# Altium schematic sheet STM32L4雷达LoRa.SchDoc
size A3
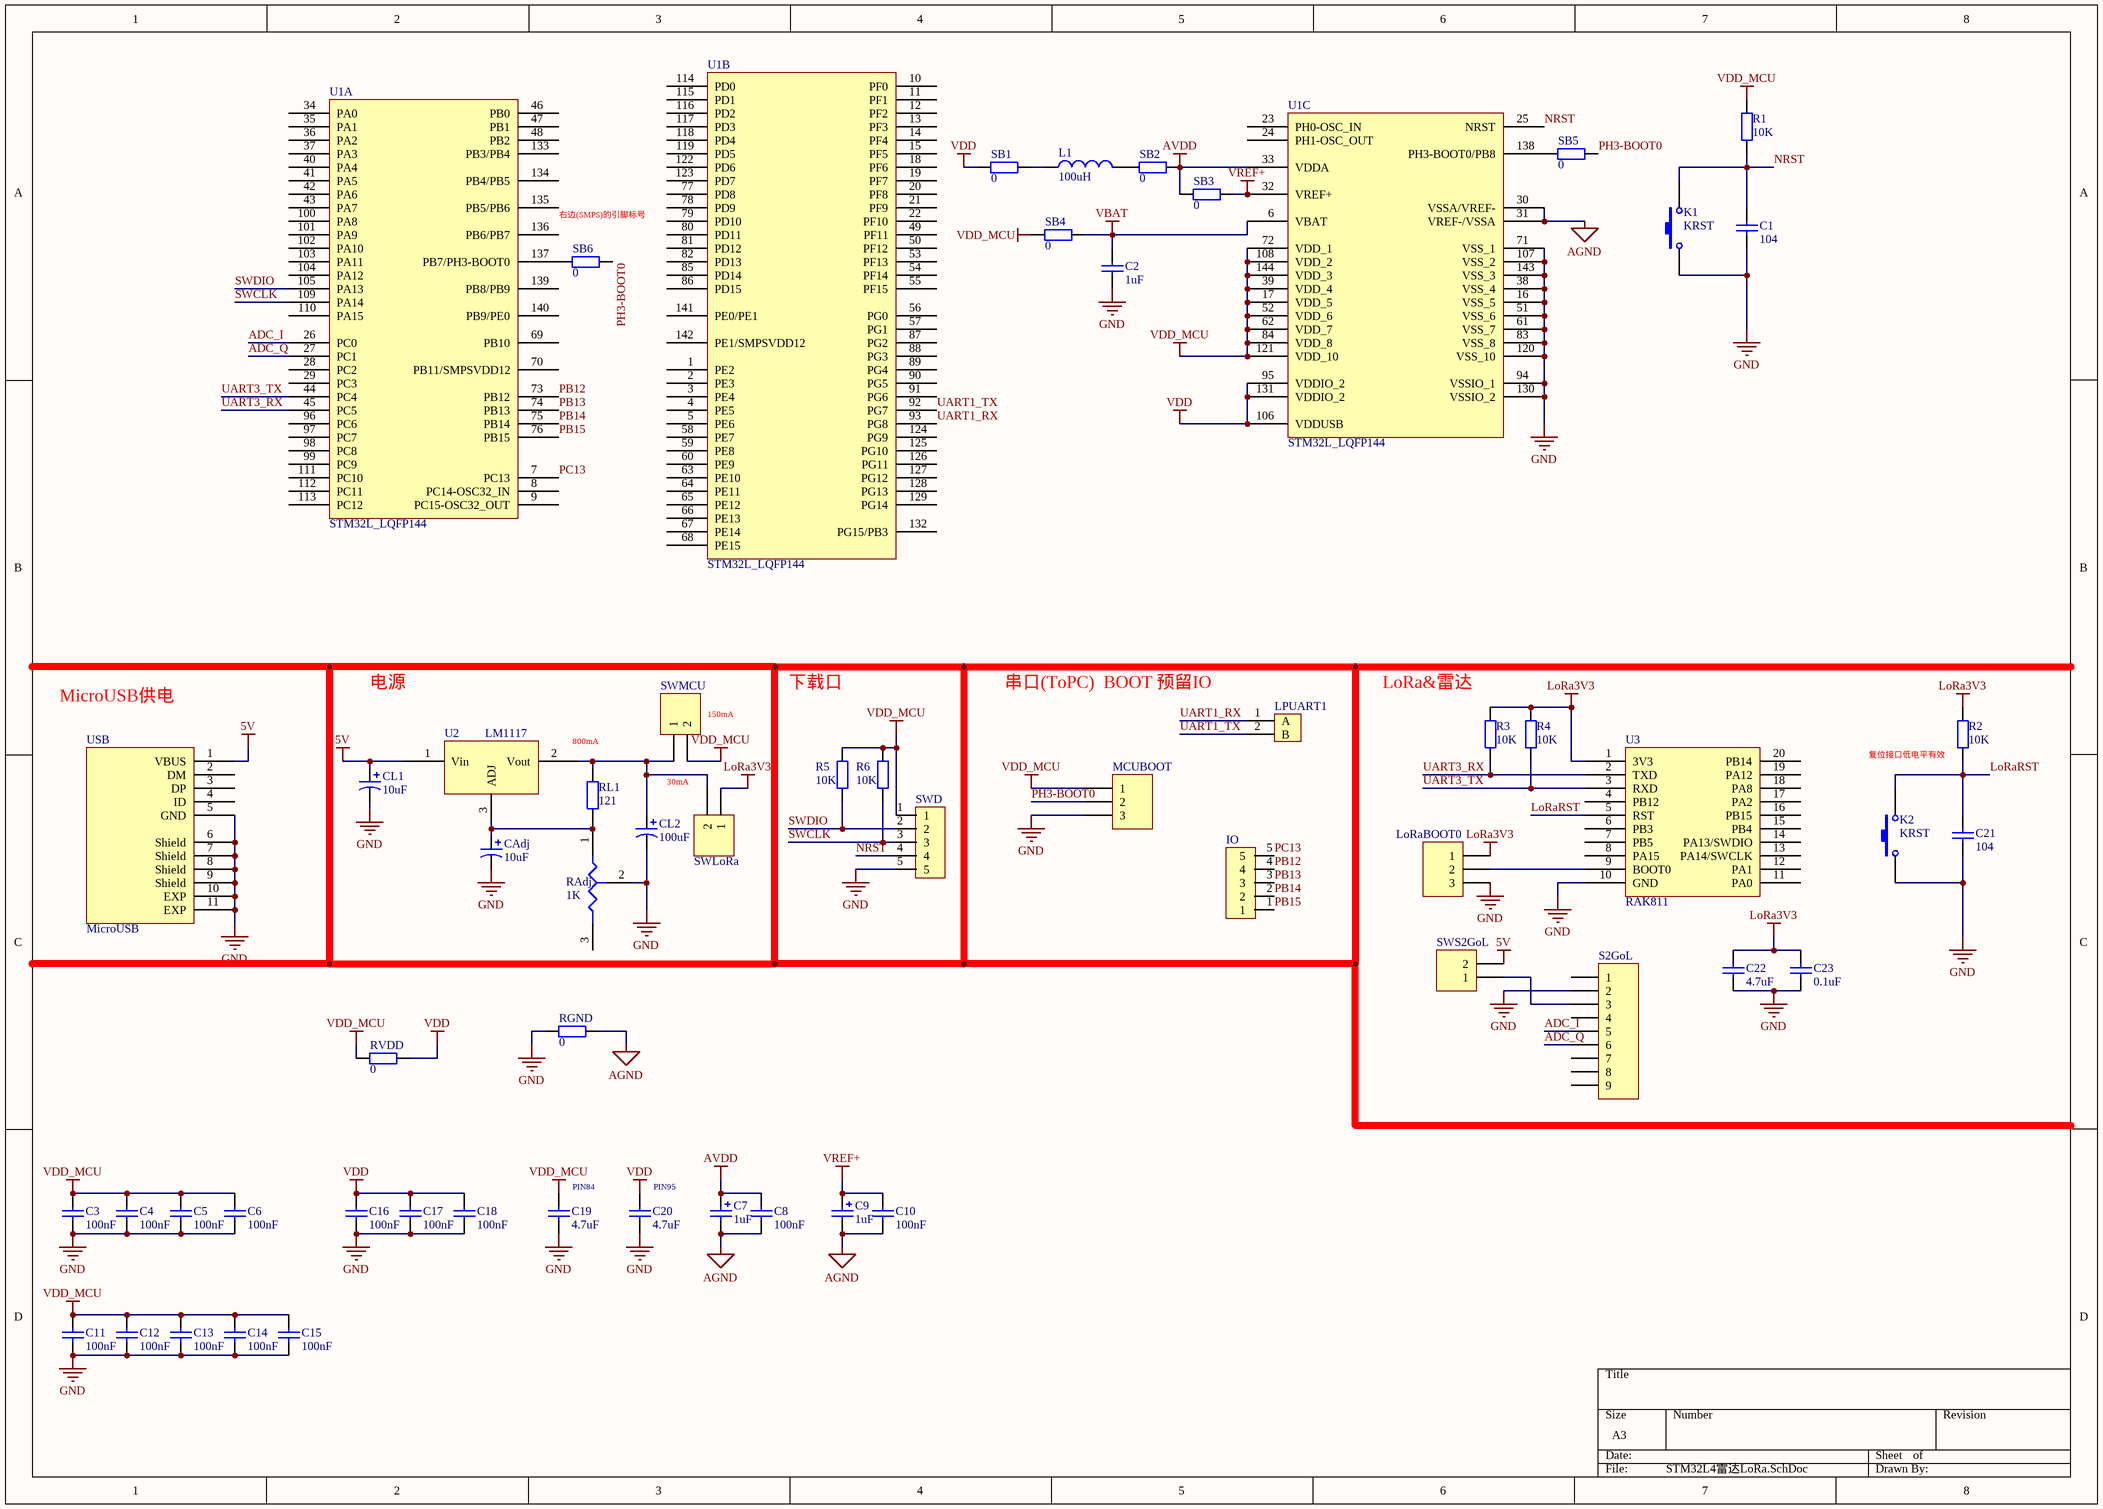
[diagram p0: STM32L4雷达LoRa.SchDoc]

## Parts
C1  104  [0603C]
C2  1uF  [0603C]
C3  100nF  [0603C]
C4  100nF  [0603C]
C5  100nF  [0603C]
C6  100nF  [0603C]
C7  1uF  [TAN-A]
C8  100nF  [0603C]
C9  1uF  [TAN-A]
C10  100nF  [0603C]
C11  100nF  [0603C]
C12  100nF  [0603C]
C13  100nF  [0603C]
C14  100nF  [0603C]
C15  100nF  [0603C]
C16  100nF  [0603C]
C17  100nF  [0603C]
C18  100nF  [0603C]
C19  4.7uF  [0603C]
C20  4.7uF  [0603C]
C21  104  [0603C]
C22  4.7uF  [0603C]
C23  0.1uF  [0603C]
CAdj  10uF  [极性电容]
CL1  10uF  [极性电容]
CL2  100uF  [极性电容]
IO  5P  [5P]  (value not drawn)
K1  KRST  [四角按键]
K2  KRST  [四角按键]
L1  100uH  [Inductor0603L]
LoRaBOOT0  Header 3  [HDR1X3]  (value not drawn)
LPUART1  2P  [SIP2]  (value not drawn)
MCUBOOT  Header 3  [HDR1X3]  (value not drawn)
R1  10K  [0603R]
R2  10K  [0603R]
R3  10K  [0603R]
R4  10K  [0603R]
R5  10K  [0603R]
R6  10K  [0603R]
RAdj  1K  [电位器]
RGND  0  [0603R]
RL1  121  [0603R]
RVDD  0  [0603R]
S2GoL  Header 9  [HDR1X9]  (value not drawn)
SB1  0  [0603R]
SB2  0  [0603R]
SB3  0  [0603R]
SB4  0  [0603R]
SB5  0  [0603R]
SB6  0  [0603R]
SWD  5P  [5P]  (value not drawn)
SWLoRa  Header 2  [HDR1X2]  (value not drawn)
SWMCU  Header 2  [HDR1X2]  (value not drawn)
SWS2GoL  Header 2  [HDR1X2]  (value not drawn)
U1  STM32L_LQFP144  [STM32L496LQFP144]  (parts A,B,C of 3)
U2  LM1117  [LM1117]
U3  RAK811  [RAK811Breakout]
USB  MicroUSB  [MicroUSB]

## Nets
5V: CL1.1 SWS2GoL.2 U2.1(Vin) USB.1(VBUS)
AGND: C7.2 C8.1 C9.2 C10.1 RGND.2 U1.30(VSSA/VREF-) U1.31(VREF-/VSSA)
AVDD: C7.1 C8.2 SB2.2 SB3.1 U1.33(VDDA)
GND: C1.1 C2.1 C3.1 C4.1 C5.1 C6.1 C11.1 C12.1 C13.1 C14.1 C15.1 C16.1 C17.1 C18.1 C19.1 C20.1 C21.1 C22.1 C23.1 CAdj.2 CL1.2 CL2.2 K1.1 K2.1 LoRaBOOT0.3 MCUBOOT.3 RAdj.2(TAP) RGND.1 S2GoL.2 SWD.5 U1.16(VSS_5) U1.38(VSS_4) U1.51(VSS_6) U1.61(VSS_7) U1.71(VSS_1) U1.83(VSS_8) U1.94(VSSIO_1) U1.107(VSS_2) U1.120(VSS_10) U1.130(VSSIO_2) U1.143(VSS_3) U3.10(GND) USB.5(GND) USB.6(Shield) USB.7(Shield) USB.8(Shield) USB.9(Shield) USB.10(EXP) USB.11(EXP)
LoRa3V3: C22.2 C23.2 LoRaBOOT0.1 R2.2 R3.2 R4.2 SWLoRa.1 U3.1(3V3)
VBAT: C2.2 SB4.2 U1.6(VBAT)
VDD: C16.2 C17.2 C18.2 C20.2 RVDD.2 SB1.1 U1.95(VDDIO_2) U1.106(VDDUSB) U1.131(VDDIO_2)
VDD_MCU: C3.2 C4.2 C5.2 C6.2 C11.2 C12.2 C13.2 C14.2 C15.2 C19.2 MCUBOOT.1 R1.2 R5.2 R6.2 RVDD.1 SB4.1 SWD.1 SWMCU.2 U1.17(VDD_5) U1.39(VDD_4) U1.52(VDD_6) U1.62(VDD_7) U1.72(VDD_1) U1.84(VDD_8) U1.108(VDD_2) U1.121(VDD_10) U1.144(VDD_3)
VREF+: C9.1 C10.2 SB3.2 U1.32(VREF+)
ADC_I: S2GoL.5 U1.26(PC0)
ADC_Q: S2GoL.6 U1.27(PC1)
LoRaRST: C21.2 K2.2 R2.1 U3.5(RST)
NRST: C1.2 K1.2 R1.1 SWD.4 U1.25(NRST)
PB12: IO.4 U1.73(PB12)
PB13: IO.3 U1.74(PB13)
PB14: IO.2 U1.75(PB14)
PB15: IO.1 U1.76(PB15)
PC13: IO.5 U1.7(PC13)
PH3-BOOT0: MCUBOOT.2 SB5.2 SB6.2
SWCLK: R6.1 SWD.3 U1.109(PA14)
SWDIO: R5.1 SWD.2 U1.105(PA13)
UART1_RX: LPUART1.1(A) U1.93(PG8)
UART1_TX: LPUART1.2(B) U1.92(PG7)
UART3_RX: R3.1 U1.45(PC5) U3.2(TXD)
UART3_TX: R4.1 U1.44(PC4) U3.3(RXD)
NetCAdj_1: CAdj.1 RAdj.1(A) RL1.1 U2.3(ADJ)
NetCL2_1: CL2.1 RL1.2 SWLoRa.2 SWMCU.1 U2.2(Vout)
NetL1_1: L1.1 SB1.2
NetL1_2: L1.2 SB2.1
NetLoRaBOOT0_2: LoRaBOOT0.2 U3.9(BOOT0)
NetS2GoL_3: S2GoL.3 SWS2GoL.1
NetSB5_1: SB5.1 U1.138(PH3-BOOT0/PB8)
NetSB6_1: SB6.1 U1.137(PB7/PH3-BOOT0)

Not connected (* = marked no-connect by the designer): RAdj 3(B); S2GoL 1 4 7 8 9; U1 1(PE2) 2(PE3) 3(PE4) 4(PE5) 5(PE6) 8(PC14-OSC32_IN) 9(PC15-OSC32_OUT) 10(PF0) 11(PF1) 12(PF2) 13(PF3) 14(PF4) 15(PF5) 18(PF6) 19(PF7) 20(PF8) 21(PF9) 22(PF10) 23(PH0-OSC_IN) 24(PH1-OSC_OUT) 28(PC2) 29(PC3) 34(PA0) 35(PA1) 36(PA2) 37(PA3) 40(PA4) 41(PA5) 42(PA6) 43(PA7) 46(PB0) 47(PB1) 48(PB2) 49(PF11) 50(PF12) 53(PF13) 54(PF14) 55(PF15) 56(PG0) 57(PG1) 58(PE7) 59(PE8) 60(PE9) 63(PE10) 64(PE11) 65(PE12) 66(PE13) 67(PE14) 68(PE15) 69(PB10) 70(PB11/SMPSVDD12) 77(PD8) 78(PD9) 79(PD10) 80(PD11) 81(PD12) 82(PD13) 85(PD14) 86(PD15) 87(PG2) 88(PG3) 89(PG4) 90(PG5) 91(PG6) 96(PC6) 97(PC7) 98(PC8) 99(PC9) 100(PA8) 101(PA9) 102(PA10) 103(PA11) 104(PA12) 110(PA15) 111(PC10) 112(PC11) 113(PC12) 114(PD0) 115(PD1) 116(PD2) 117(PD3) 118(PD4) 119(PD5) 122(PD6) 123(PD7) 124(PG9) 125(PG10) 126(PG11) 127(PG12) 128(PG13) 129(PG14) 132(PG15/PB3) 133(PB3/PB4) 134(PB4/PB5) 135(PB5/PB6) 136(PB6/PB7) 139(PB8/PB9) 140(PB9/PE0) 141(PE0/PE1) 142(PE1/SMPSVDD12); U3 4(PB12) 6(PB3) 7(PB5) 8(PA15) 11(PA0) 12(PA1) 13(PA14/SWCLK) 14(PA13/SWDIO) 15(PB4) 16(PB15) 17(PA2) 18(PA8) 19(PA12) 20(PB14); USB 2(DM) 3(DP) 4(ID)

## Notes on the sheet
- 右边(SMPS)的引脚标号
- MicroUSB供电
- 电源
- (near SWMCU) 150mA
- 下载口
- 串口(ToPC)  BOOT 预留IO
- (near R3) LoRa&雷达
- 800mA
- 30mA
- 复位接口低电平有效
- (near C19) PIN84
- (near C20) PIN95

## Library data of the parts
C1-C6 C8 C10-C23 = 贴片电容
C7 C9 = 贴片钽电容
CAdj CL1 CL2 = 极性电容
K1 K2 = 四角按键
L1 = Inductor
LoRaBOOT0 MCUBOOT = Header 3: Header, 3-Pin; LatestRevisionDate: 17-Jul-2002; LatestRevisionNote: Re-released for DXP Platform.; Publisher: Altium Limited
R1-R6 RGND RL1 RVDD SB1-SB6 = 贴片电阻
RAdj = 电位器
S2GoL = Header 9: Header, 9-Pin; LatestRevisionDate: 17-Jul-2002; LatestRevisionNote: Re-released for DXP Platform.; Publisher: Altium Limited
SWLoRa SWMCU SWS2GoL = Header 2: Header, 2-Pin; LatestRevisionDate: 17-Jul-2002; LatestRevisionNote: Re-released for DXP Platform.; Publisher: Altium Limited
U1 = STM32L496
U3 = RAK811Breakout